# Altium schematic sheet ConnectionPinout.SchDoc
size C
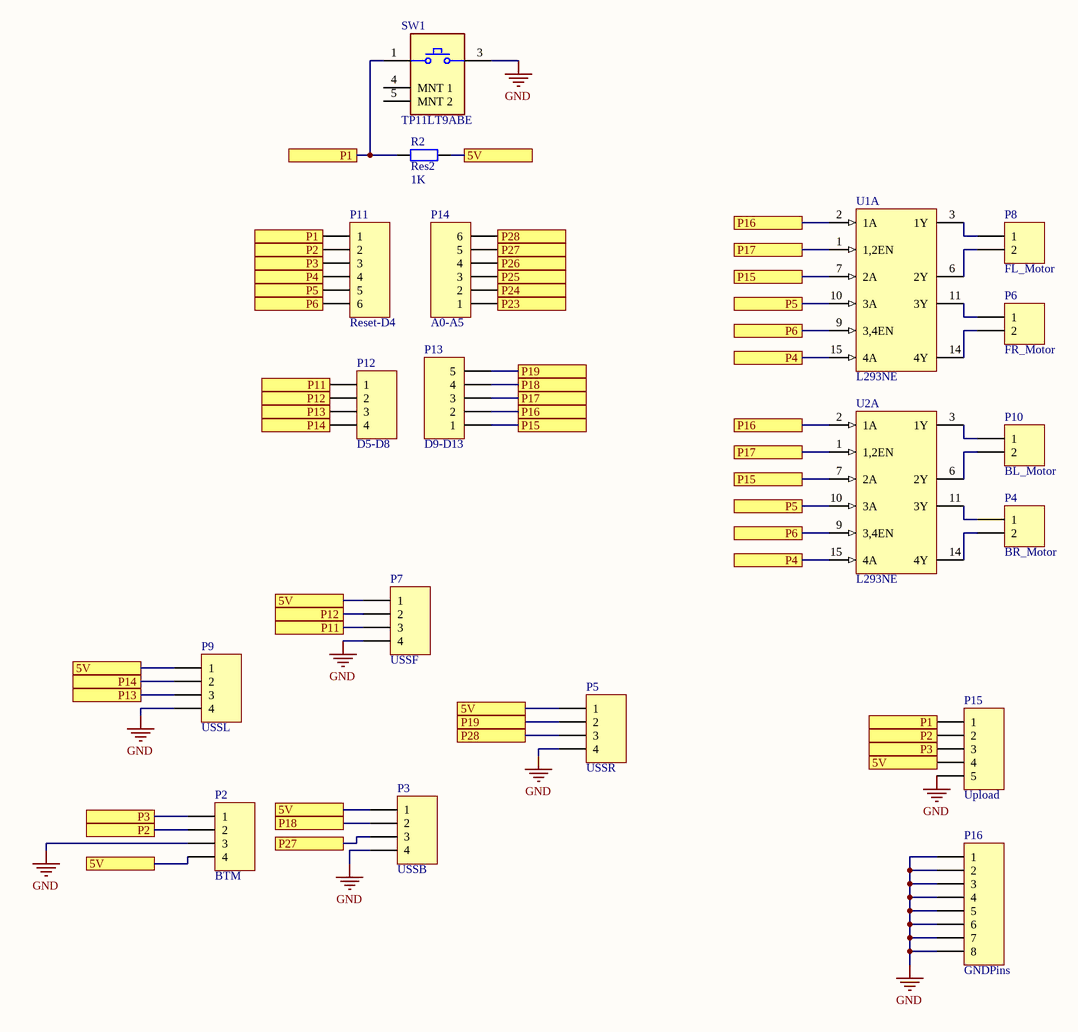
[diagram p0: ConnectionPinout.SchDoc]

## Parts
P2  BTM  [HDR1X4]
P3  USSB  [HDR1X4]
P4  BR_Motor  [HDR1X2]
P5  USSR  [HDR1X4]
P6  FR_Motor  [HDR1X2]
P7  USSF  [HDR1X4]
P8  FL_Motor  [HDR1X2]
P9  USSL  [HDR1X4]
P10  BL_Motor  [HDR1X2]
P11  Reset-D4  [HDR1X6]
P12  D5-D8  [HDR1X4]
P13  D9-D13  [HDR1X5]
P14  A0-A5  [HDR1X6]
P15  Upload  [HDR1X5]
P16  GNDPins  [HDR1X8]
R2  Res2  value 1K  [AXIAL-0.4]
SW1  TP11LT9ABE  [FP-TP11LT9ABE-0]
U1  L293NE  [NE0016A]  (part A of 2)
U2  L293NE  [NE0016A]  (part A of 2)

## Ports
5V, P1, P2, P3, P4, P5, P6, P11, P12, P13, P14, P15, P16, P17, P18, P19, P23, P24, P25, P26, P27, P28

## Nets
GND: P2.3 P3.4 P5.4 P7.4 P9.4 P15.5 P16.1 P16.2 P16.3 P16.4 P16.5 P16.6 P16.7 P16.8 SW1.3
5V: P2.4 P3.1 P5.1 P7.1 P9.1 P15.4 R2.2 ; port 5V
P1: P11.1 P15.1 R2.1 SW1.1 ; port P1
P2: P2.2 P11.2 P15.2 ; port P2
P3: P2.1 P11.3 P15.3 ; port P3
P4: P11.4 U1.15(4A) U2.15(4A) ; port P4
P5: P11.5 U1.10(3A) U2.10(3A) ; port P5
P6: P11.6 U1.9(3,4EN) U2.9(3,4EN) ; port P6
P11: P7.3 P12.1 ; port P11
P12: P7.2 P12.2 ; port P12
P13: P9.3 P12.3 ; port P13
P14: P9.2 P12.4 ; port P14
P15: P13.1 U1.7(2A) U2.7(2A) ; port P15
P16: P13.2 U1.2(1A) U2.2(1A) ; port P16
P17: P13.3 U1.1(1,2EN) U2.1(1,2EN) ; port P17
P18: P3.2 P13.4 ; port P18
P19: P5.2 P13.5 ; port P19
P23: P14.1 ; port P23
P24: P14.2 ; port P24
P25: P14.3 ; port P25
P26: P14.4 ; port P26
P27: P3.3 P14.5 ; port P27
P28: P5.3 P14.6 ; port P28
NetP4_1: P4.1 U2.11(3Y)
NetP4_2: P4.2 U2.14(4Y)
NetP6_1: P6.1 U1.11(3Y)
NetP6_2: P6.2 U1.14(4Y)
NetP8_1: P8.1 U1.3(1Y)
NetP8_2: P8.2 U1.6(2Y)
NetP10_1: P10.1 U2.3(1Y)
NetP10_2: P10.2 U2.6(2Y)

Not connected (* = marked no-connect by the designer): SW1 4(MNT_1) 5(MNT_2)

## Library data of the parts
P2 P3 P5 P7 P9 P12 = Header 4: Header, 4-Pin; LatestRevisionDate: 17-Jul-2002; LatestRevisionNote: Re-released for DXP Platform.; Publisher: Altium Limited
P4 P6 P8 P10 = Header 2: Header, 2-Pin; LatestRevisionDate: 17-Jul-2002; LatestRevisionNote: Re-released for DXP Platform.; Publisher: Altium Limited
P11 P14 = Header 6: Header, 6-Pin; LatestRevisionDate: 17-Jul-2002; LatestRevisionNote: Re-released for DXP Platform.; Publisher: Altium Limited
P13 P15 = Header 5: Header, 5-Pin; LatestRevisionDate: 17-Jul-2002; LatestRevisionNote: Re-released for DXP Platform.; Publisher: Altium Limited
P16 = Header 8: Header, 8-Pin; LatestRevisionDate: 17-Jul-2002; LatestRevisionNote: Re-released for DXP Platform.; Publisher: Altium Limited
R2 = Res2: Resistor 10k ohm; Published: 8-Jun-2000; LatestRevisionDate: 17-Jul-2002; LatestRevisionNote: Re-released for DXP Platform.; PackageReference: AXIAL-0.4; Publisher: Altium Limited; PackageDescription: Axial Device, Thru-Hole; 2 Leads; 0.4 in Pin Spacing
SW1 = CMP-10035-000001-1: SWITCH PUSH SPST-NO 0.4VA 20V; Manufacturer: C&K Components; Contact Resistance: 20mΩ; Electromechanical Life: 60000Cycles; Throw Configuration: SPST(NO); Mouser Description: Pushbutton Switches Switch Pb Spst Mom Sealed Ra Pcb; Voltage Rating Dc: 20V; Digikey Description: SWITCH PUSH SPST-NO 0.4VA 20V; Automotive: No; Height: 5.33mm; Voltage Rating Ac: 20V; Device Class L1: Electromechanical; ComponentLink2Description: Datasheet; Manufacturer Part Number: TP11LT9ABE; Device Class L2: Switches; Temperature Range Low: -30°C; Category: Switch; Temperature Range High: +85°C; Lead Free: Yes; Octopart: https://octopart.com/tp11lt9abe-c%26k+components-1173646; Device Class L3: Pushbutton Switches; Package: TP11LT9ABE; ComponentLink2URL: https://upverter.com/datasheet/0786a1a96b71ed81f4db7fca9904a91be8d020ff.pdf; RoHS: TRUE; Temperature: -30°C to +85°C; Mount: Through Hole
U1 U2 = CMP-2000-04965-1: Quadruple Half-H Driver, 4.5 to 36 V, 0 to 70 degC, 16-Pin DIP, Pb-Free, Tube; Manufacturer: Texas Instruments; Rad Hard: No; Package Version: 4040054/B, 04/1995; Maximum Operating Current: 24mA; Packaging: Rail/Tube; Mounting: ThroughHole; Manufacturer URL: http://www.ti.com/; Type: 4-ChannelMotorDriver; Datasheet Version: Rev. D, 01/2016; Package Reference: NE16; Operating Temperature: 0to70degC; Package: 16PDIP; Package Description: 16-Pin Plastic Dual-In-Line Package, Body 19.8 x 6.35 mm, Pitch 2.54 mm; Category: MotionMotorControl; Datasheet URL: http://www.ti.com/general/docs/lit/getliterature.tsp?genericPartNumber=l293d&fileType=pdf; Package URL: http://www.ti.com/litv/pdf/mpdi003